# Altium schematic sheet PWM_Driver.SchDoc
size A4
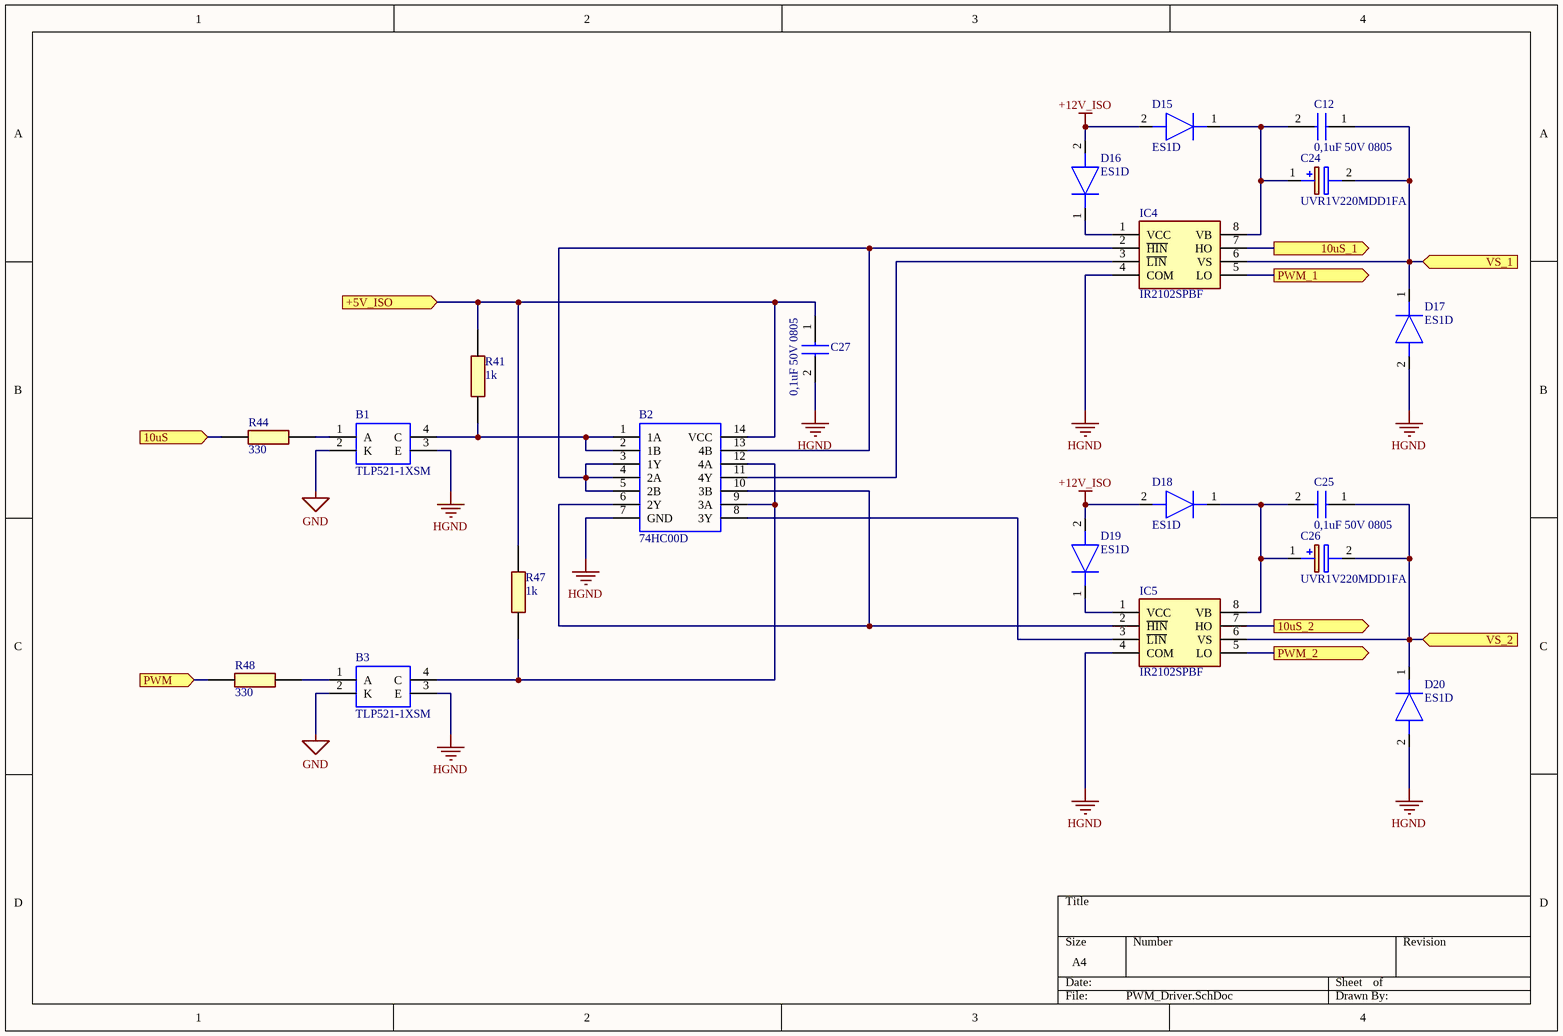
[diagram p0: PWM_Driver.SchDoc]

## Parts
B1  TLP521-1XSM  [SOP254P1016X460-4N]
B2  74HC00D  [SOIC127P600X175-14N]
B3  TLP521-1XSM  [SOP254P1016X460-4N]
C12  0,1uF 50V 0805  [CAPC2012X90N]
C24  UVR1V220MDD1FA  [CAPPRD200W50D525H1250]
C25  0,1uF 50V 0805  [CAPC2012X90N]
C26  UVR1V220MDD1FA  [CAPPRD200W50D525H1250]
C27  0,1uF 50V 0805  [CAPC2012X90N]
D15  ES1D  [DIOM5226X295N]
D16  ES1D  [DIOM5226X295N]
D17  ES1D  [DIOM5226X295N]
D18  ES1D  [DIOM5226X295N]
D19  ES1D  [DIOM5226X295N]
D20  ES1D  [DIOM5226X295N]
IC4  IR2102SPBF  [SOIC127P600X175-8N]
IC5  IR2102SPBF  [SOIC127P600X175-8N]
R41  1k  [RESC2013X65N]
R44  330  [RESC2013X65N]
R47  1k  [RESC2013X65N]
R48  330  [RESC2013X65N]

## Ports
10uS (in), 10uS_1 (out), 10uS_2 (out), +5V_ISO (in), PWM (in), PWM_1 (out), PWM_2 (out), VS_1 (in), VS_2 (in)

## Nets
+12V_ISO: D15.2(A) D16.2(A) D18.2(A) D19.2(A)
GND: B1.2(K) B3.2(K)
HGND: B1.3(E) B2.7(GND) B3.3(E) C27.2 D17.2(A) D20.2(A) IC4.4(COM) IC5.4(COM)
10uS: R44.1 ; port 10uS
10uS_1: IC4.7(HO) ; port 10uS_1
10uS_2: IC5.7(HO) ; port 10uS_2
+5V_ISO: B2.14(VCC) C27.1 R41.1 R47.1 ; port +5V_ISO
PWM: R48.1 ; port PWM
PWM_1: IC4.5(LO) ; port PWM_1
PWM_2: IC5.5(LO) ; port PWM_2
VS_1: C12.1 C24.2(-) D17.1(K) IC4.6(VS) ; port VS_1
VS_2: C25.1 C26.2(-) D20.1(K) IC5.6(VS) ; port VS_2
NetB1_1: B1.1(A) R44.2
NetB1_4: B1.4(C) B2.1(1A) B2.2(1B) R41.2
NetB2_3: B2.3(1Y) B2.4(2A) B2.5(2B) B2.13(4B) IC4.2(~{HIN})
NetB2_6: B2.6(2Y) B2.10(3B) IC5.2(~{HIN})
NetB2_8: B2.8(3Y) IC5.3(~{LIN})
NetB2_9: B2.9(3A) B2.12(4A) B3.4(C) R47.2
NetB2_11: B2.11(4Y) IC4.3(~{LIN})
NetB3_1: B3.1(A) R48.2
NetC12_2: C12.2 C24.1(+) D15.1(K) IC4.8(VB)
NetC25_2: C25.2 C26.1(+) D18.1(K) IC5.8(VB)
NetD16_1: D16.1(K) IC4.1(VCC)
NetD19_1: D19.1(K) IC5.1(VCC)

## Library data of the parts
B1 B3 = TLP521-1XSM: Optocoupler; SMD; Channels:1; Out: transistor; Uinsul:5.3kV; Manufacturer_Name: Isocom; Geometry.Height: 4.6mm; Manufacturer_Part_Number: TLP521-1XSM; Mouser Part Number: *; Mouser Price/Stock: *; Arrow Part Number: *; Arrow Price/Stock: *; Mouser Testing Part Number: *; Mouser Testing Price/Stock: *; Datasheet Link: https://datasheet.lcsc.com/szlcsc/Isocom-Components-TLP521-1XSM_C83157.pdf
B2 = 74HC00D: NEXPERIA - 74HC00D - NAND Gate, 74HC00, 2 Input, 5.2 mA, 2 V to 6 V, SOIC-14; Geometry.Height: 1.75mm; Manufacturer_Name: Nexperia; Manufacturer_Part_Number: 74HC00D; Mouser Part Number: 771-74HC00D; Mouser Price/Stock: https://www.mouser.co.uk/ProductDetail/Nexperia/74HC00D?qs=Q7xBXtx7xQgKEyQZmXe6mg%3D%3D; Arrow Part Number: *; Arrow Price/Stock: *; Mouser Testing Part Number: *; Mouser Testing Price/Stock: *; Datasheet Link: https://altium.componentsearchengine.com/Datasheets/2/74HC00D.pdf
C12 C25 C27 = MCMT21N470F250CT: Capacitor; Height: 0.9mm
C24 C26 = UVR1V220MDD1FA: Capacitor Polarised; Manufacturer_Name: Nichicon; Datasheet Link: https://componentsearchengine.com/Datasheets/1/UVR1V220MDD1FA.pdf; Height: 12.5mm; Manufacturer_Part_Number: UVR1V220MDD1FA; Mouser Part Number: 647-UVR1V220MDD1FA; Mouser Price/Stock: https://www.mouser.co.uk/ProductDetail/Nichicon/UVR1V220MDD1FA/?qs=aEaV1LakhLZp9mEQuSYOqQ%3D%3D
D15-D20 = ES1D: Diode; Manufacturer_Name: SMC; Datasheet Link: https://4donline.ihs.com/images/VipMasterIC/IC/SMCD/SMCD-S-A0005425901/SMCD-S-A0005425901-1.pdf?hkey=833C7E3902CC3CD9C0453977398360A8; Height: 2.95mm; Manufacturer_Part_Number: ES1D
IC4 IC5 = IR2102SPBF: Integrated Circuit; Manufacturer_Name: Infineon; Datasheet Link: https://www.infineon.com/cms/en/product/power/gate-driver-ics/?; Height: 1.75mm; Manufacturer_Part_Number: IR2102SPBF; Mouser Part Number: 942-IR2102SPBF; Mouser Price/Stock: https://www.mouser.co.uk/ProductDetail/Infineon-IR/IR2102SPBF?qs=dQmlx5f5cRJqfCRMLAcrGg%3D%3D; Arrow Part Number: IR2102SPBF; Arrow Price/Stock: https://www.arrow.com/en/products/ir2102spbf/infineon-technologies-ag?region=nac
R41 R44 R47 R48 = ERJP06J822V: Resistor; Height: 0.7mm